# EAGLE board BRD1001-001-002-320 - Switching Register (EAGLE 9.4.2)
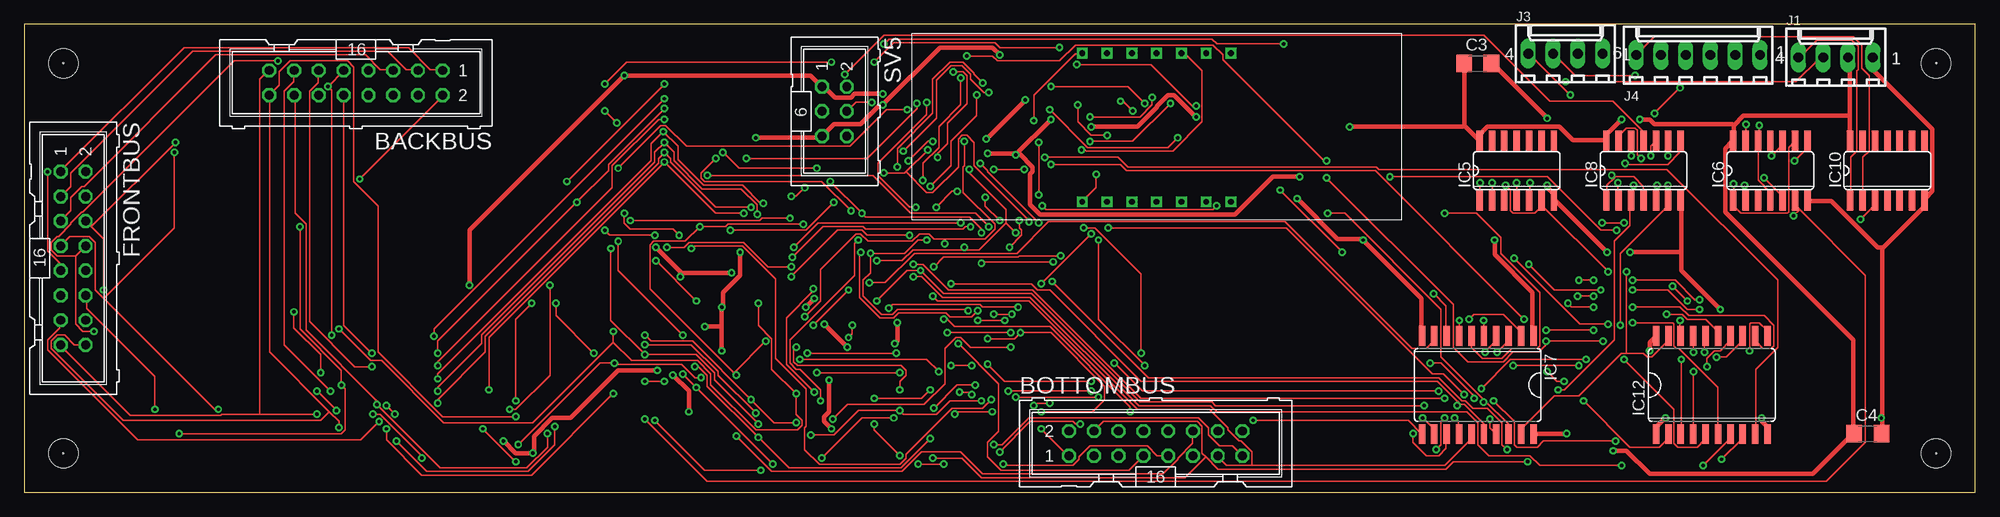
[diagram p1: board, top side]
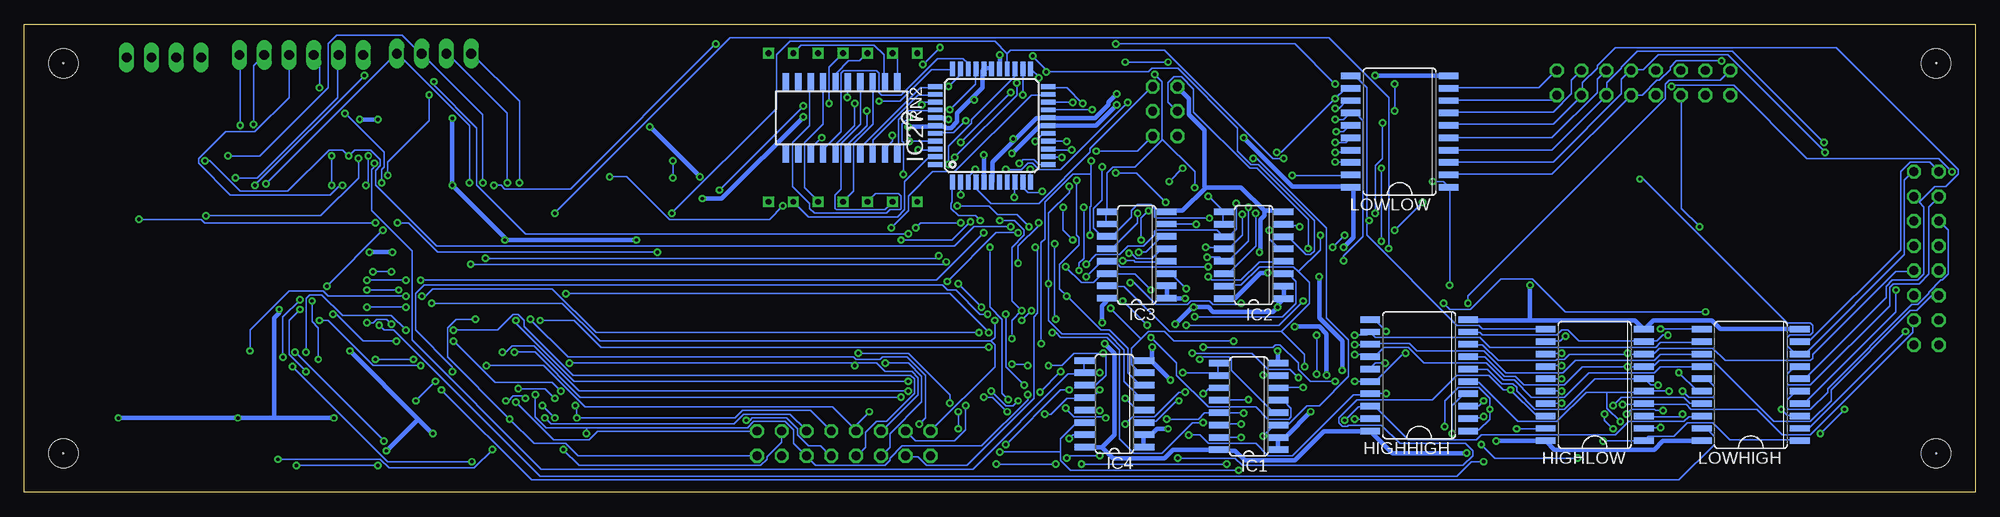
[diagram p2: board, bottom side, seen from below]

Size 200 x 48 mm. Coordinates in mm from the lower left corner, seen from the top.
Outline: 0,0 200,0 200,48 0,48 0,0
Copper layers (1*16): Top 0.035mm / dielectric 1.5mm / Bottom 0.035mm
Design rules "default *": minimum track width 6mil, minimum drill 0.35mm, track to track 6mil, track to pad 6mil, pad to pad 6mil, via to via 6mil, smd to smd 6mil, copper to edge 40mil, drill to drill 6mil, minimum pad ring 10mil, minimum via ring 8mil, stop-mask expansion 4mil, vias tented up to drill 0mil, thermal gap 10mil
Net classes: 2 power: width 0.457 mm
Holes 0.12 mm at 4,4 196,44 4,44 196,4
Holes 3 mm at 4,44 4,4 196,4 196,44

## Footprints (pad centres in the part's own frame; a part is rotated, then mirrored left to right if it is on the bottom)
ML16 = drill 0.914 octagon: 1 -8.89,-1.27; 2 -8.89,1.27; 3 -6.35,-1.27; 4 -6.35,1.27; 5 -3.81,-1.27; 6 -3.81,1.27; 7 -1.27,-1.27; 8 -1.27,1.27; 9 1.27,-1.27; 10 1.27,1.27; 11 3.81,-1.27; 12 3.81,1.27; 13 6.35,-1.27; 14 6.35,1.27; 15 8.89,-1.27; 16 8.89,1.27
C1206 = smd 1.6 x 1.8: 1 -1.4,0; 2 1.4,0
SO20W = smd 0.66 x 2.032: 1 -5.715,-5.029; 2 -4.445,-5.029; 3 -3.175,-5.029; 4 -1.905,-5.029; 5 -0.635,-5.029; 6 0.635,-5.029; 7 1.905,-5.029; 8 3.175,-5.029; 9 4.445,-5.029; 10 5.715,-5.029; 11 5.715,5.029; 12 4.445,5.029; 13 3.175,5.029; 14 1.905,5.029; 15 0.635,5.029; 16 -0.635,5.029; 17 -1.905,5.029; 18 -3.175,5.029; 19 -4.445,5.029; 20 -5.715,5.029
SO16 = smd 0.66 x 2.032: 1 -4.445,-3.073; 2 -3.175,-3.073; 3 -1.905,-3.073; 4 -0.635,-3.073; 5 0.635,-3.073; 6 1.905,-3.073; 7 3.175,-3.073; 8 4.445,-3.073; 9 4.445,3.073; 10 3.175,3.073; 11 1.905,3.073; 12 0.635,3.073; 13 -0.635,3.073; 14 -1.905,3.073; 15 -3.175,3.073; 16 -4.445,3.073
SO14 = smd 0.66 x 2.032: 1 -3.81,-3.073; 2 -2.54,-3.073; 3 -1.27,-3.073; 4 0,-3.073; 5 1.27,-3.073; 6 2.54,-3.073; 7 3.81,-3.073; 8 3.81,3.073; 9 2.54,3.073; 10 1.27,3.073; 11 0,3.073; 12 -1.27,3.073; 13 -2.54,3.073; 14 -3.81,3.073
TQFP44 = smd 1.5 x 0.5: 1 -5.8,4; 2 -5.8,3.2; 3 -5.8,2.4; 4 -5.8,1.6; 5 -5.8,0.8; 6 -5.8,0; 7 -5.8,-0.8; 8 -5.8,-1.6; 9 -5.8,-2.4; 10 -5.8,-3.2; 11 -5.8,-4; 23 5.8,-4; 24 5.8,-3.2; 25 5.8,-2.4; 26 5.8,-1.6; 27 5.8,-0.8; 28 5.8,0; 29 5.8,0.8; 30 5.8,1.6; 31 5.8,2.4; 32 5.8,3.2; 33 5.8,4 | smd 0.5 x 1.5: 12 -4,-5.8; 13 -3.2,-5.8; 14 -2.4,-5.8; 15 -1.6,-5.8; 16 -0.8,-5.8; 17 0,-5.8; 18 0.8,-5.8; 19 1.6,-5.8; 20 2.4,-5.8; 21 3.2,-5.8; 22 4,-5.8; 34 4,5.8; 35 3.2,5.8; 36 2.4,5.8; 37 1.6,5.8; 38 0.8,5.8; 39 0,5.8; 40 -0.8,5.8; 41 -1.6,5.8; 42 -2.4,5.8; 43 -3.2,5.8; 44 -4,5.8
6410-04 = drill 1.016 long: 1 3.81,0; 2 1.27,0; 3 -1.27,0; 4 -3.81,0
6410-06 = drill 1.016 long: 1 6.35,0; 2 3.81,0; 3 1.27,0; 4 -1.27,0; 5 -3.81,0; 6 -6.35,0
SOMC20 = smd 1.91 x 0.64: 1 -3.62,5.715; 2 -3.62,4.445; 3 -3.62,3.175; 4 -3.62,1.905; 5 -3.62,0.635; 6 -3.62,-0.635; 7 -3.62,-1.905; 8 -3.62,-3.175; 9 -3.62,-4.445; 10 -3.62,-5.715; 11 3.62,-5.715; 12 3.62,-4.445; 13 3.62,-3.175; 14 3.62,-1.905; 15 3.62,-0.635; 16 3.62,0.635; 17 3.62,1.905; 18 3.62,3.175; 19 3.62,4.445; 20 3.62,5.715
ML6 = drill 0.914 octagon: 1 -2.54,-1.27; 2 -2.54,1.27; 3 0,-1.27; 4 0,1.27; 5 2.54,-1.27; 6 2.54,1.27
4-DIGIT-7-SEGMENT = drill 0.6 square: PIN1 17.48,1.88; PIN2 20.02,1.88; PIN3 22.56,1.88; PIN4 25.1,1.88; PIN5 27.64,1.88; PIN6 30.18,1.88; PIN7 32.72,1.88; PIN8 32.72,17.12; PIN9 30.18,17.12; PIN10 27.64,17.12; PIN11 25.1,17.12; PIN12 22.56,17.12; PIN13 20.02,17.12; PIN14 17.48,17.12

## Placement (x,y rotation side)
BACKBUS  [ML16]  34,42 180 top
BOTTOMBUS  [ML16]  116,5 0 top
C3  1uF  [C1206]  149,44 0 top
C4  1uF  [C1206]  189,6 0 top
FRONTBUS  [ML16]  5,24 270 top
HIGHHIGH  74AC245DW  [SO20W]  57,12 90 bottom
HIGHLOW  74AC245DW  [SO20W]  39,11 90 bottom
IC1  74HC173D  [SO16]  74.47,8.8 90 bottom
IC2  74HC173D  [SO16]  73.96,24.32 90 bottom
IC3  74HC173D  [SO16]  85.95,24.34 90 bottom
IC4  74HC173D  [SO16]  88.25,9.07 90 bottom
IC5  74ALS21D  [SO14]  153,33 0 top
IC6  74ALS21D  [SO14]  179,33 0 top
IC7  74AC245DW  [SO20W]  149,11 180 top
IC8  74ALS08D  [SO14]  166,33 0 top
IC10  74LS32D  [SO14]  191,33 0 top
IC12  74AC245DW  [SO20W]  173,11 0 top
IC27  MEGA8535-A  [TQFP44]  100.83,37.62 90 bottom
J1  22-27-2041-04  [6410-04]  185.7,44.61 0 top
J3  22-27-2041-04  [6410-04]  158,45 0 top
J4  22-27-2061-06  [6410-06]  171.6,44.86 0 top
LOWHIGH  74AC245DW  [SO20W]  23,11 90 bottom
LOWLOW  74AC245DW  [SO20W]  59,37 90 bottom
RN2  [SOMC20]  116.21,38.41 270 bottom
SV5  [ML6]  83.05,39.08 270 top
U$1  4-DIGIT-7-SEGMENT  [4-DIGIT-7-SEGMENT]  90.98,27.92 0 top

## Tracks (layer width: path | path; a pad name or v marks a point on that pad's centre or on a via)
!HIGH_HIGH  (via drill 0.35)
  Top 0.152: v63.62,7.5 70,1.12 184.75,1.12 188.75,5.12 188.75,22.25 182,29 | 182,29 181.62,29.38 181.62,29.88 IC6.6 | v165.75,34.25 165.38,34.62 165.38,37.12 165.12,37.38 164.25,37.38 163.5,36.62 163.5,36.12 IC8.13 | 182,29 v181.38,28.38
  Bottom 0.152: v63.62,7.5 62.12,7.5 HIGHHIGH.19 | v165.75,34.25 165.75,32.25 169.62,28.38 v181.38,28.38
!HIGH_LOW  (via drill 0.35)
  Top 0.152: v50.38,3.12 v47,6.5 | v163.62,17.12 163.62,24.5 168.5,29.38 168.5,29.88 IC8.6 168.5,30 v168.5,31.5 | v168.5,34.5 168.5,36 IC8.9
  Bottom 0.152: v47,6.5 44.12,6.5 HIGHLOW.19 | v50.38,3.12 51.62,3.12 53.12,1.62 147.12,1.62 162.12,16.62 163.12,16.62 v163.62,17.12 | v168.5,31.5 v168.5,34.5
!IN  (via drill 0.35)
  Top 0.152: IC6.4 179,30.75 177.75,32 177.75,36 IC6.12 177.75,36.12 177.88,36.25 v177.88,37.62
  Bottom 0.152: v177.88,37.62 177.88,44.75 J4.1
!IN_HIGH_HIGH  (via drill 0.35)
  Top 0.152: v178.38,32.25 180.25,30.38 180.25,30 IC6.5
  Bottom 0.152: v178.38,32.25 176.12,32.25 167.88,40.5 167.88,44.75 J4.5
!IN_HIGH_LOW  (via drill 0.35)
  Top 0.152: v167.38,31.5 167.38,30 IC8.5
  Bottom 0.152: v167.38,31.5 167.62,31.5 168.62,30.5 178.88,30.5 182.12,33.75 182.12,34.25 179.38,37 176.38,37 172.88,40.5 172.88,44.75 J4.3
!IN_LOW_HIGH  (via drill 0.35)
  Top 0.152: v163.38,31.75 163.38,30 IC8.2 | v169.75,41.5 v167.12,38.88
  Bottom 0.152: v163.38,31.75 163.38,33.12 163.12,33.38 163.12,34.88 v167.12,38.88 | v169.75,41.5 169.75,44.25 170.25,44.75 J4.4
!IN_LOW_LOW  (via drill 0.35)
  Top 0.152: v176.5,37.75 176.5,36.12 IC6.13
  Bottom 0.152: v176.5,37.75 176.5,43.75 175.5,44.75 J4.2
!LOW_HIGH  (via drill 0.35)
  Top 0.152: v157.25,10.5 157.88,10.5 163,15.62 163,25.75 164.62,27.38 164.62,29.88 IC8.3 164.75,30 165,30.25 v165,31.5 | v164.75,34.5 164.75,36 IC8.12
  Bottom 0.152: v157.25,10.5 148,1.25 30.38,1.25 26.75,4.88 26.75,5.75 27.5,6.5 28,6.5 LOWHIGH.19 | v164.75,34.5 164.75,31.75 v165,31.5
!LOW_LOW  (via drill 0.35)
  Top 0.152: v70,32.5 87,32.5 90.88,28.62 97.5,28.62 v98.88,27.25 | v166.75,34.5 166.75,35.5 167.25,36 IC8.10 | v181.5,34 182.75,35.25 182.75,36 IC6.8
  Bottom 0.152: v70,32.5 64.12,32.5 LOWLOW.19 | v98.88,27.25 102.62,27.25 104.62,25.25 157.75,25.25 164,31.5 164,33 163.5,33.5 163.5,34.12 164.5,35.12 166.12,35.12 v166.75,34.5 167.38,35.12 168.75,35.12 173,30.88 177.88,30.88 181,34 v181.5,34
!OUT  (via drill 0.35)
  Top 0.152: IC6.9 181.5,36 180.88,35.38 180.88,28.75 180.75,28.62 176,28.62 175.25,29.38 175.25,29.88 IC6.1 175.25,30 v175.25,31.62 | v154.38,31.75 154.38,30 IC5.5
  Bottom 0.152: v154.38,31.75 154.38,37.62 161.75,45 J3.1 161.88,45 v175.25,31.62
!OUT_HIGH  (via drill 0.35)
  Top 0.152: v150.5,31.75 150.5,30 IC5.2 | v176.38,31.5 176.38,30 IC6.2 | v165.12,42.75 159,42.75 156.75,45 J3.3
  Bottom 0.152: v150.5,31.75 150.5,38.88 156.62,45 J3.3 | v165.12,42.75 v176.38,31.5
!OUT_LOW  (via drill 0.35)
  Top 0.152: v153,31.75 IC5.4 | v179.12,34.5 180.25,35.62 180.25,36 IC6.10
  Bottom 0.152: v153,31.75 153,38.75 159.25,45 J3.2 159.38,45 161.25,46.88 168,46.88 168.88,46 168.88,41.5 175.88,34.5 v179.12,34.5
!OUT_SWAP  (via drill 0.35)
  Top 0.152: 163,32.25 163.12,32.38 165,32.38 166,31.38 IC8.4 | 163,32.25 162.25,31.5 162.25,30 IC8.1 | v149.25,31.75 149.25,30 IC5.1 | v162.75,32.5 163,32.25 | v158.5,40.75 154.25,45 J3.4
  Bottom 0.152: v149.25,31.75 149.25,40.12 154.12,45 J3.4 | v162.75,32.5 162.75,33.88 158.5,38.12 v158.5,40.75
!REG_IN_HIGH  (via drill 0.35)
  Top 0.152: v164.12,33.75 164.25,33.62 168.5,33.62 169.75,34.88 169.75,36 IC8.8 | v89.75,12.25 v81.25,12.25
  Bottom 0.152: 77.62,12.25 77.62,13.12 IC1.9 | 77.62,12.25 77.62,12 IC1.10 77.62,12.25 | IC4.10 91.38,12.25 91.38,13.5 IC4.9 | v164.12,33.75 164.12,33.38 164.38,33.12 164.38,28.88 160.25,24.75 160.25,15.62 147,2.38 102.75,2.38 93,12.12 91.38,12.12 IC4.10 | v81.25,12.25 77.62,12.25 | v89.75,12.25 91.25,12.25 IC4.10
!REG_IN_LOW  (via drill 0.35)
  Top 0.152: IC8.11 166,37 162.88,40.12 156.38,40.12 149.62,46.88 88.12,46.88 v84.12,42.88 | v78.62,30.38 79.12,30.38 v80,31.25
  Bottom 0.152: IC2.10 77.12,27.5 77.12,28.75 IC2.9 77.12,28.88 v78.62,30.38 | IC3.10 89.12,27.62 89.12,28.75 IC3.9 89,28.88 89,32.75 88.38,33.38 86.12,33.38 83.38,36.12 83.38,36.25 | v84.12,42.88 83.38,42.12 83.38,36.25 | v80,31.25 80,32.88 83.38,36.25
!REG_OUT  (via drill 0.35)
  Top 0.152: 164.25,14.25 166,14.25 166.38,13.88 166.88,13.88 168.5,15.5 168.5,16 IC12.19 | 164.25,14.25 163.75,14.25 159.38,9.88 156.88,9.88 153.5,6.5 153.5,6 IC7.19 | 155.62,29.38 155.62,29.88 IC5.6 155.62,29.38 | v162.38,22.62 155.62,29.38 | 164.25,14.25 v164.25,22.62 | v49.75,8.5 50.38,8.5 53.88,12 v53.88,21.25 | v38.12,5.25 41.25,2.12 51.62,2.12 54.38,4.88 v54.38,6.75 | 155.62,29.38 154.88,28.62 152.62,28.62 152.38,28.88 152.38,31 v151.88,31.5 | v129.12,46 122.25,46 121.75,46.5 88.62,46.5 v88.12,46 | v55.62,31.88 v65.62,41.88
  Bottom 0.152: v164.25,22.62 v162.38,22.62 | LOWHIGH.1 18,5.38 25.12,5.38 26.88,7.12 29.5,7.12 30.88,5.75 33.5,5.75 33.88,5.38 HIGHLOW.1 34,5.25 v38.12,5.25 | v53.88,21.25 53.88,31.25 LOWLOW.1 54,31.38 54.5,31.88 v55.62,31.88 | HIGHHIGH.1 51.88,6.38 50.88,6.38 49.75,7.5 v49.75,8.5 49.75,9.62 50.88,10.75 53,10.75 54.38,9.38 v54.38,6.75 | v151.88,31.5 151.12,31.5 150.75,31.12 144,31.12 v129.12,46 | v88.12,46 69.75,46 v65.62,41.88
A
  Bottom 0.152: IC27.37 106.75,39.12 109.5,39.12 110.38,38.25 110.38,34.88 RN2.20
B  (via drill 0.35)
  Top 0.152: v108,39.75 108,38 109.38,36.62 v111,36.62
  Bottom 0.152: v108,39.75 107.75,40 106.75,40 IC27.36 | v111,36.62 111,36 111.75,35.25 111.75,34.88 RN2.19
BUS0  (via drill 0.35)
  Top 0.152: v78.5,28.12 75.62,28.12 75.38,27.88 v62.12,27.88 | v104.62,34.38 112.12,34.38 113.12,33.38 138.62,33.38 138.88,33.12 168.38,33.12 179.75,21.75 179.75,14.88 177.5,12.62 177.5,6 IC12.9 | v98.25,42 97.38,42.88 97.38,43 96.25,44.12 94.88,44.12 93.12,42.38 93.12,38.88 89.5,35.25 v89.5,33.38
  Bottom 0.152: 62.38,27.88 62.38,41.5 63.5,42.62 64,42.62 LOWLOW.11 | 62.38,27.88 62.38,26.38 53.12,17.12 50.88,17.12 50.5,16.75 44.12,16.75 HIGHLOW.11 | v78.5,28.12 84,28.12 84.12,28.25 84.12,29.12 84.5,29.5 85.88,29.5 86.5,28.88 86.5,28.25 88.5,26.25 89,26.25 IC3.11 89.12,26.25 89.5,26.25 90.38,27.12 90.38,29.12 89.5,30 v89.5,33.38 | 62.38,27.88 v62.12,27.88 | v104.62,34.38 98.25,40.75 v98.25,42
BUS1  (via drill 0.35)
  Top 0.152: v42,16 42,16.75 v65.62,40.38 | v82.62,31.88 v85.88,28.62 86.25,28.25 96.88,28.25 98.12,27 v98.12,26.62 | v81.25,33.25 73.25,33.25 v71.62,34.88 | v174,3.38 176.12,5.5 176.12,5.88 IC12.8 | v152,4.38 151.5,4.88 151.5,7.12 150,8.62 148.5,8.62 147.75,9.38 147.38,9.38 145,11.75 115.25,11.75 v105.38,21.62
  Bottom 0.152: v42,16 42.5,15.5 44,15.5 HIGHLOW.12 | LOWLOW.12 64.12,41.38 64.62,41.38 v65.62,40.38 71.12,34.88 v71.62,34.88 | v85.88,28.62 85.88,27.62 88.5,25 89,25 IC3.12 | v81.25,33.25 v82.62,31.88 | v174,3.38 163.5,3.38 162.62,2.5 153.88,2.5 v152,4.38 | v105.38,21.62 100.38,26.62 v98.12,26.62
BUS2  (via drill 0.35)
  Top 0.152: v42.38,14.25 42.38,15.5 v56.62,29.75 59.88,33 59.88,33.62 v65.62,39.38 | v78.62,23.12 76.25,23.12 73.75,25.62 68.12,25.62 67.62,25.12 v65.88,25.12 | v64.62,26.38 60,26.38 v59.5,26.88 | v172.12,2.75 174.88,5.5 174.88,5.88 IC12.7 | v163.75,2.75 155.38,2.75 154.38,3.75 150.12,3.75 149,4.88 149,7.12 147.88,8.25 122.25,8.25 121.62,8.88 114.25,8.88 103.12,20 94.12,20 92,22.12 v91.12,22.12
  Bottom 0.152: v42.38,14.25 44,14.25 HIGHLOW.13 | v65.62,39.38 65.25,39.38 64.5,40.12 64.12,40.12 LOWLOW.13 | v78.62,23.12 87.62,23.12 88.12,23.62 89,23.62 IC3.13 89.12,23.62 89.62,23.62 v91.12,22.12 | v64.62,26.38 v65.88,25.12 | v56.62,29.75 v59.5,26.88 | v163.75,2.75 v172.12,2.75
BUS3  (via drill 0.35)
  Top 0.152: v42.38,13 42.38,13.38 60.25,31.25 60.25,33.5 65,38.25 v65.62,38.25 | v80.88,17.12 v84.5,20.75 | v64.75,23.75 v68.88,19.62 | v164.88,17.38 169,17.38 169.12,17.25 169.12,15 169.38,14.75 169.62,14.75 173.62,10.75 173.62,6 IC12.6 | v162.38,17.25 159.5,17.25 v152.75,24 | v106.25,24.25 102,24.25 101.88,24.12 94.25,24.12 v93.25,23.12
  Bottom 0.152: v42.38,13 44,13 HIGHLOW.14 | v65.62,38.25 64.75,38.25 64.12,38.88 LOWLOW.14 64,38.88 63.5,38.88 62.75,38.12 62.75,26.25 64.75,24.25 v64.75,23.75 | v84.5,20.75 86.12,22.38 89,22.38 IC3.14 89.12,22.38 89.5,22.38 90.38,21.5 91.62,21.5 v93.25,23.12 | v80.88,17.12 71.38,17.12 v68.88,19.62 | v164.88,17.38 164.25,17.38 163.88,17.75 162.88,17.75 v162.38,17.25 | v152.75,24 106.5,24 v106.25,24.25
BUS4  (via drill 0.35)
  Top 0.152: v42.38,11.62 42.38,12.12 64.25,34 64.25,35.75 v65.5,37 67,35.5 67,34.12 69.62,31.5 73.62,31.5 75.5,29.62 v75.75,29.62 | v164,13.62 169.12,8.5 169.12,5 169.5,4.62 171.5,4.62 172.25,5.38 172.25,5.88 IC12.5 | v160.12,13.62 152.38,13.62 v149.38,10.62 | v145.62,9.62 114.5,9.62 103.38,20.75 94.75,20.75 92.12,23.38 v91.12,23.38
  Bottom 0.152: v42.38,11.62 44,11.62 HIGHLOW.15 | v65.5,37 64.75,37 64.12,37.62 LOWLOW.15 | v75.75,29.62 75.75,27 76.5,26.25 77,26.25 IC2.11 77.12,26.25 77.75,26.88 84,26.88 84.12,26.75 84.12,26.38 85.25,25.25 86.88,25.25 87.75,24.38 90.12,24.38 v91.12,23.38 | v160.12,13.62 v164,13.62 | v149.38,10.62 146.62,10.62 v145.62,9.62
BUS5  (via drill 0.35)
  Top 0.152: v42.38,10.38 42.38,10.75 46.88,15.25 46.88,16.12 64.62,33.88 64.62,34.88 v65.62,35.88 66.62,34.88 66.62,34 69.5,31.12 73.5,31.12 75.12,29.5 v75.12,28.5 | v171.12,12.38 171.12,6 IC12.4 | v171.75,18.75 170.5,18.75 168.5,20.75 v164.88,20.75 | v161.62,20.75 156.88,20.75 v154.25,23.38 | v105.5,23.62 98.25,23.62 v98.12,23.5 | v96,27.62 81.38,27.62 v78.88,25.12
  Bottom 0.152: v42.38,10.38 44,10.38 HIGHLOW.16 | v65.62,35.88 64.5,35.88 64.12,36.25 LOWLOW.16 | v75.12,28.5 75.12,26.38 76.5,25 77,25 IC2.12 77.12,25 77.25,25.12 v78.88,25.12 | v171.12,12.38 172.88,14.12 172.88,17.62 v171.75,18.75 | v161.62,20.75 v164.88,20.75 | v154.25,23.38 105.75,23.38 v105.5,23.62 | v98.12,23.5 98.12,25.25 96,27.38 v96,27.62
BUS6  (via drill 0.35)
  Top 0.152: v42.38,9.12 42.38,9.5 47.25,14.38 47.25,16 65,33.75 65,34.25 v65.62,34.88 66.25,34.25 66.25,33.88 70.88,29.25 v74.5,29.25 | v169.88,13.62 169.88,6 IC12.3 | v169,21.12 v170.5,19.62 | v163.25,26.88 161.62,26.88 156.12,32.38 v140,32.38 | v122.25,29.38 121.88,29 104.75,29 v104.38,29.38 | v97,27.25 96.5,27.25 96.25,27 86.25,27 86,27.25 81.88,27.25 v78.75,24.12
  Bottom 0.152: v42.38,9.12 44,9.12 HIGHLOW.17 | v65.62,34.88 64.25,34.88 64.12,35 LOWLOW.17 | v74.5,29.25 74.5,25.75 76.5,23.75 77,23.75 IC2.13 77.12,23.75 77.5,24.12 v78.75,24.12 | v169.88,13.62 169.88,16.88 170.5,17.5 v170.5,19.62 | v163.25,26.88 v169,21.12 | v140,32.38 138.25,32.38 133.88,28 123.62,28 v122.25,29.38 | v104.38,29.38 101.12,29.38 100.25,28.5 98.25,28.5 v97,27.25
BUS7  (via drill 0.35)
  Top 0.152: v47.62,10.5 47.62,15.88 v65.62,33.88 70.88,28.62 v73.75,28.62 | v159.88,9.38 164.62,4.62 167.62,4.62 168.5,5.5 168.5,5.88 IC12.2 | v157.88,11.38 157.12,11.38 v156.12,12.38 | v99.38,18.25 v101.25,18.25 | v97.5,11 95.62,11 v93.25,8.62 | v89.12,7.62 85.88,7.62 v81.75,3.5
  Bottom 0.152: v65.62,33.88 64.12,33.88 LOWLOW.18 | HIGHLOW.18 44.12,7.88 45,7.88 v47.62,10.5 48.38,10.5 49.88,12 53.12,12 55.62,9.5 63.38,9.5 65.25,7.62 65.25,7.12 64.88,6.75 64.38,6.75 64.25,6.88 60.88,6.88 59,5 52.25,5 51.5,4.25 51.5,3.75 52.5,2.75 75.12,2.75 75.88,3.5 v81.75,3.5 | v73.75,28.62 73.75,25.25 76.5,22.5 77,22.5 IC2.14 | v157.88,11.38 v159.88,9.38 | v156.12,12.38 156.12,12.88 159.88,16.62 159.88,20.38 159,21.25 105.88,21.25 105.38,20.75 104.5,20.75 102,18.25 v101.25,18.25 | v99.38,18.25 99.38,12.88 v97.5,11 | v93.25,8.62 92.38,7.75 89.25,7.75 v89.12,7.62
BUS8  (via drill 0.35)
  Top 0.152: v32.25,16.75 35.5,13.5 36.62,13.5 43,7.12 52.12,7.12 60.38,15.38 | v60.38,16.5 60.38,15.38 | 60.38,15.38 62.25,13.5 69,13.5 70.38,12.12 70.38,11 75,6.38 79.25,6.38 79.75,6.88 79.75,7.38 79.12,8 v79.12,10.12 76.62,12.62 76.62,15.75 75.25,17.12 v75.25,19.38 | v86.62,21.5 88.25,21.5 91.25,24.5 101.75,24.5 105,27.75 129.25,27.75 142.25,14.75 143.75,14.75 144.5,15.5 144.5,16 IC7.9
  Bottom 0.152: v32.25,16.75 28.12,16.75 LOWHIGH.11 | v60.38,16.5 61.5,17.62 62,17.62 HIGHHIGH.11 | v79.12,10.12 78.62,10.62 77.62,10.62 IC1.11 | v86.62,21.5 86.25,21.5 84,19.25 80.75,19.25 80.38,19.62 78.5,19.62 78.12,19.25 75.38,19.25 v75.25,19.38
BUS9  (via drill 0.35)
  Top 0.152: v63.62,16.12 64.25,15.5 68.5,15.5 v74.5,9.5 76.88,7.12 v79.12,7.12 | v144.5,20.38 145.75,19.12 145.75,16.12 IC7.8 | v94.62,16.38 v101.12,16.38
  Bottom 0.152: LOWHIGH.12 28.12,15.38 32.25,15.38 32.75,14.88 49.75,14.88 50.75,15.88 61.5,15.88 62,16.38 HIGHHIGH.12 62.12,16.38 62.38,16.12 v63.62,16.12 | v74.5,9.5 77.5,9.5 IC1.12 | v144.5,20.38 105.12,20.38 v101.12,16.38 | v94.62,16.38 94.25,16.38 93.75,15.88 89,15.88 87.75,14.62 87.75,5.5 86.25,4 83.38,4 80.25,7.12 v79.12,7.12
BUS10  (via drill 0.35)
  Top 0.152: v75,8.12 71.12,12 71.12,12.38 68.38,15.12 v63.62,15.12 | v147.12,17.62 147.12,16.12 IC7.7 | v101.12,14.88 97,14.88 96,15.88 95.5,15.88 94.38,14.75 94.38,11.12 92.25,9 84.38,9 v82.88,7.5
  Bottom 0.152: LOWHIGH.13 28.12,14.12 32.25,14.12 32.88,13.5 41,13.5 42.25,12.25 48.12,12.25 50.38,14.5 57.25,14.5 58,15.25 62,15.25 HIGHHIGH.13 62.12,15.12 v63.62,15.12 | v75,8.12 77.5,8.12 IC1.13 77.62,8.12 79,8.12 79.62,7.5 v82.88,7.5 | v147.12,17.62 143.62,17.62 140.88,14.88 v101.12,14.88
BUS11  (via drill 0.35)
  Top 0.152: v75.25,7 70.75,11.5 70.75,12.25 68.88,14.12 v63.62,14.12 60.12,17.62 v60.12,25 | v145.62,28.62 148.88,28.62 151.38,26.12 151.38,24.5 155.38,20.5 155.38,15 155.12,14.75 152.5,14.75 151.5,13.75 149.5,13.75 148.38,14.88 148.38,16 IC7.6
  Bottom 0.152: LOWHIGH.14 28.12,12.88 32.25,12.88 32.88,12.25 39.62,12.25 42.12,9.75 45.5,9.75 47.25,11.5 48.38,11.5 50.12,13.25 56.5,13.25 58.12,14.88 60.62,14.88 61.5,14 62,14 HIGHHIGH.14 62.12,14 62.25,14.12 v63.62,14.12 | v75.25,7 77.5,7 IC1.14 | v145.62,28.62 127.62,46.62 66.25,46.62 60.12,40.5 v60.12,25
BUS12  (via drill 0.35)
  Top 0.152: v32,8.38 v30,10.38 | v35.75,8 36.5,8 40.75,3.75 v40.75,3.5 | v50.62,4.88 59,13.25 v60.5,13.25 60.62,13.12 67.38,13.12 68.75,11.75 v69.38,11.75 | v80.25,14.25 v89.38,14.25 | v149.62,17.62 149.62,16.12 IC7.5 | v109.38,11.38 100.5,11.38 v98.75,13.12 | v95,13 v97.12,13
  Bottom 0.152: v30,10.38 29.38,9.75 26.88,9.75 26.75,9.88 26.75,10.88 27.5,11.62 28,11.62 LOWHIGH.15 | v32,8.38 32.75,8.38 32.88,8.5 35.25,8.5 v35.75,8 | v40.75,3.5 49.25,3.5 v50.62,4.88 | v60.5,13.25 61.5,13.25 62,12.75 HIGHHIGH.15 | v80.25,14.25 74.12,14.25 72.5,12.62 70.25,12.62 v69.38,11.75 | IC4.11 91.25,11 90.12,11 89.12,12 89.12,14 v89.38,14.25 92.38,14.25 93.62,13 v95,13 | v149.62,17.62 149.62,17.38 143.62,11.38 v109.38,11.38 | v98.75,13.12 97.25,13.12 v97.12,13
BUS13  (via drill 0.35)
  Top 0.152: v89.75,10.5 89.75,11.38 90.38,12 90.38,12.5 89.88,13 79.25,13 78.88,13.38 78.88,14.62 v79.12,14.88 | v63.62,11.38 v65.62,11.38 | v30.38,12.25 30.38,14.12 27.62,16.88 v27.62,18.5 | v54.5,19.38 54.5,18.12 v58.38,14.25 | v149.75,14.38 150.88,15.5 150.88,16 IC7.4 | v101.62,9.75 v110.12,9.75 | v99.25,8.25 95.62,8.25 v95.38,8
  Bottom 0.152: v89.75,10.5 90.5,9.75 91.25,9.75 IC4.12 91.38,9.62 93.12,9.62 94.75,8 v95.38,8 | v79.12,14.88 72,14.88 71.75,15.12 71.25,15.12 69.38,13.25 69.38,12.62 68.12,11.38 v65.62,11.38 | v63.62,11.38 62.12,11.38 HIGHHIGH.16 62,11.38 61.5,11.38 58.62,14.25 v58.38,14.25 | v30.38,12.25 28.5,10.38 28.12,10.38 LOWHIGH.16 | v27.62,18.5 42,18.5 45.38,21.88 48.62,21.88 51.75,18.75 53.88,18.75 v54.5,19.38 | v149.75,14.38 147.62,14.38 143,9.75 v110.12,9.75 | v101.62,9.75 100.75,9.75 v99.25,8.25
BUS14  (via drill 0.35)
  Top 0.152: v38,8 v37.12,8.88 | v37.12,6.5 37.12,5.38 40.75,1.75 52,1.75 v60.38,10.12 | v80.62,5.88 83,5.88 85.5,8.38 v89.75,8.38 90.12,8 93.5,8 94.88,9.38 v98.12,9.38 | v151,14.38 152.12,15.5 152.12,16 IC7.3 | v100.88,10.38 v109.38,10.38
  Bottom 0.152: v37.12,8.88 36.25,9.75 29.88,9.75 29.25,9.12 28.12,9.12 LOWHIGH.17 | v38,8 38,7.38 v37.12,6.5 | v60.38,10.12 62,10.12 HIGHHIGH.17 62.12,10 63.75,10 70,3.75 72.5,3.75 73.75,5 78.62,5 79.5,5.88 v80.62,5.88 | v89.75,8.38 91.25,8.38 IC4.13 | v151,14.38 150.62,14.38 150,15 147.75,15 143.12,10.38 v109.38,10.38 | v100.88,10.38 99.38,8.88 98.62,8.88 v98.12,9.38
BUS15  (via drill 0.35)
  Top 0.152: v75.5,2.25 69.75,2.25 v64.62,7.38 | v148.12,17.75 148.62,18.25 151.62,18.25 153.38,16.5 153.38,16.12 IC7.2 | v108.25,7 107.75,7 107.5,7.25 103.12,7.25 v100,4.12
  Bottom 0.152: LOWHIGH.18 28.12,7.75 29.38,7.75 29.88,7.25 35.5,7.25 36.88,5.88 50.62,5.88 51.12,5.38 58.12,5.38 61.5,8.75 62,8.75 HIGHHIGH.18 62.12,8.75 63.25,8.75 v64.62,7.38 | 93.75,4.12 93.75,3.25 92.75,2.25 v75.5,2.25 | 93.75,4.12 93.75,5.5 92.12,7.12 91.38,7.12 IC4.14 | v148.12,17.75 144.25,13.88 115,13.88 114.75,13.62 112.25,13.62 112,13.88 109.5,13.88 107.62,12 107.62,7.62 v108.25,7 | 93.75,4.12 v100,4.12
C
  Bottom 0.152: IC27.35 106.75,40.75 108.38,40.75 113,36.12 113,34.88 RN2.18
CLEAR  (via drill 0.35)
  Top 0.152: v68.75,12.88 69.12,12.88 70,12 70,10.88 v75.25,5.62 78.38,2.5 89.88,2.5 v92.88,5.5 | v188.25,28 189.62,29.38 189.62,29.88 IC10.3 | v161.75,27.62 v164,27.62 | v128.75,31 v135.12,24.62 | v120.12,39.62 119.75,39.62 115.5,43.88 v107.88,43.88 | v106.12,45.62 100,45.62 99.5,46.12 89.12,46.12 v87.12,44.12 | v82.75,44.12 61.75,44.12 v59.5,41.88 | v60.75,37.88 v59.5,39.12 | v61.5,28.62 61.5,27.62 62.12,27 66.5,27 v67.12,26.38
  Bottom 0.152: 69.38,22.62 68.25,21.5 68.25,19.38 71.12,16.5 | 69.38,22.62 69.88,23.12 73.38,23.12 75.25,21.25 77,21.25 IC2.15 | 71.12,16.5 82.62,16.5 87.25,21.12 89,21.12 IC3.15 | v75.25,5.62 IC1.15 | v68.75,12.88 68.75,14.12 71.12,16.5 | v92.88,5.5 92.5,5.88 91.38,5.88 IC4.15 | v188.25,28 181.88,28 181.5,27.62 v164,27.62 | v161.75,27.62 160.62,27.62 157.62,24.62 v135.12,24.62 | v120.12,39.62 v128.75,31 | v106.12,45.62 v107.88,43.88 | v82.75,44.12 v87.12,44.12 | v59.5,39.12 v59.5,41.88 | v60.75,37.88 60.75,34.25 61.5,33.5 v61.5,28.62 | v67.12,26.38 67.12,24.88 69.38,22.62
CLK  (via drill 0.35)
  Top 0.152: v79.88,27.5 72.12,27.5 71.88,27.25 v69.25,27.25 67.75,25.75 64.5,25.75 64.12,25.38 64.12,20.88 72.75,12.25 | 72.75,12.25 v76,15.5 | 72.75,12.25 v73,12 | v158,42.12 181.62,42.12 184,44.5 184.38,44.5 J1.3 | v104.25,21.38 v109.38,26.5 | v101.88,19 98.25,19 98,19.25 89,19.25 v88.62,18.88
  Bottom 0.152: v69.25,27.25 69.38,27.38 70.88,27.38 IC2.7 | v79.88,27.5 82.88,27.5 IC3.7 | v73,12 71.5,12 IC1.7 | 85.5,15.75 84.75,16.5 83.12,16.5 82.12,15.5 v76,15.5 | 85.5,15.75 86.5,14.75 86.5,13.12 85.62,12.25 85.25,12.25 IC4.7 | v158,42.12 158,41.75 153.62,37.38 153.62,31.5 148.62,26.5 v109.38,26.5 | v101.88,19 v104.25,21.38 | 85.5,15.75 v88.62,18.88
D
  Bottom 0.152: IC27.34 106.75,41.5 108.12,41.5 114.25,35.38 114.25,34.88 RN2.17
DIG0  (via drill 0.35)
  Top 0.152: v103.5,38.12 103.5,40.75 107.75,45 108.38,45 U$1.PIN14
  Bottom 0.152: v103.5,38.12 104.75,36.88 106.62,36.88 IC27.40
DIG1  (via drill 0.35)
  Top 0.152: v109.25,36 113.62,36 v117.5,39.88
  Bottom 0.152: v109.25,36 106.75,36 IC27.41 | v117.5,39.88 117.5,43.62 116.12,45 U$1.PIN11
DIG2  (via drill 0.35)
  Top 0.152: v108.38,35.12 108.75,35.12 108.88,35 117.75,35 120.75,38 120.75,43.25 119,45 118.62,45 U$1.PIN10
  Bottom 0.152: v108.38,35.12 106.75,35.12 IC27.42
DIG3
  Bottom 0.152: IC27.43 106.75,34.38 107.25,34.38 109.75,31.88 109.75,29 110.5,28.25 119.62,28.25 121.12,29.75 U$1.PIN6
DP  (via drill 0.35)
  Top 0.152: v105.12,39.25 109,35.38 117.25,35.38 v118.25,36.38
  Bottom 0.152: v105.12,39.25 102.5,41.88 102.5,43.38 IC27.30 | v118.25,36.38 119.38,35.25 119.38,34.88 RN2.13
E  (via drill 0.35)
  Top 0.152: v112.38,40.12 112.62,40.12 v113.62,39.12
  Bottom 0.152: v112.38,40.12 110.25,40.12 107,43.38 104.88,43.38 IC27.33 | v113.62,39.12 113.62,37.62 115.5,35.75 115.5,34.88 RN2.16
F  (via drill 0.35)
  Top 0.152: v105.25,41.62 113.12,41.62 v114.88,39.88
  Bottom 0.152: v105.25,41.62 104.12,42.75 104.12,43.38 IC27.32 | v114.88,39.88 114.88,37.62 116.75,35.75 116.75,34.88 RN2.15
G
  Bottom 0.152: IC27.31 103.25,43.5 103.25,44 103.75,44.5 106.38,44.5 110.12,40.75 112.12,40.75 112.38,41 112.38,43 112.62,43.25 116,43.25 116.25,43 116.25,37 118,35.25 118,34.88 RN2.14
GND  (via drill 0.35)
  Top 0.457: v156.12,38.38 150.5,44 C3.2 | v156.12,31.5 156.12,31.25 156.75,30.62 156.75,30 IC5.7 157,29.88 v162.25,24.62 | IC7.10 143.25,16.12 143.25,19.88 v137.25,25.88 137.12,26 134.62,26 v130.5,30.12 | v150.75,25.88 150.75,24.38 154.62,20.5 154.62,16.12 IC7.1 | v168.25,7.62 167.38,6.75 167.38,6 IC12.1 | v178.12,7.62 178.12,7.25 178.62,6.75 178.62,6 IC12.10 | 169.88,24.62 169.88,22.75 v173.88,18.75 | 169.88,24.62 169.88,29.88 IC8.7 | 190.5,25 190.5,7.62 | 190.5,7.62 190.5,6 C4.2 | 190.5,25 194.75,29.25 194.75,29.88 IC10.7 194.88,30.12 195.62,30.88 195.62,37.25 189.62,43.25 189.62,44.5 J1.1 | IC6.7 182.88,29.88 185.25,29.88 190,25.12 190.38,25.12 190.5,25 | v190.38,7.62 190.5,7.62 | 169.88,24.62 v164.62,24.62 | v82.5,11.5 82.5,8.25 82,7.75 82,7.25 v82.75,6.5 | 71.5,17 v71.5,19 71.62,19.12 71.62,20.5 73.38,22.25 v73.38,24.62 | 71.5,17 v71.5,14.5 | v68.12,8.25 68.12,10.38 v66.5,12 | 71.5,17 v69.75,17 | v80.12,19 v81,19.88 | v82,17.25 v84.38,14.88 | v98.62,36.25 v102.62,40.25 | v88,40.88 85.12,40.88 84.75,40.5 83.12,40.5 82,41.62 SV5.1 81.75,41.62 80.62,42.75 v61.5,42.75 45.62,26.88 v45.62,21.25 | v120.12,38.5 117.88,40.75 117.25,40.75 116.12,39.62 116.12,39.5 114.12,37.5 v109.38,37.5
  Bottom 0.457: v156.12,38.38 v156.12,31.5 150.62,26 | v137.25,25.88 150.5,25.88 150.62,26 | v150.75,25.88 150.62,26 | 174.38,7.62 v178.12,7.62 v190.38,7.62 | 174.38,7.62 v168.25,7.62 | v173.88,18.75 173.88,18.38 174.38,17.88 174.38,7.62 | v164.62,24.62 v162.25,24.62 | LOWHIGH.10 18,16.75 26.12,16.75 27,17.62 33,17.62 33.88,16.75 HIGHLOW.10 34.12,16.88 34.88,17.62 45.62,17.62 | 45.62,17.62 51.88,17.62 HIGHHIGH.10 | IC4.1 85.25,4.62 85.25,5.88 IC4.2 85,6 84.38,6 83.88,6.5 v82.75,6.5 | v82.5,11.5 84.5,13.5 85.12,13.5 IC4.8 84.38,13.62 v84.38,14.88 | IC3.2 82.88,21.12 82.88,20 IC3.1 82.75,19.88 v81,19.88 | IC1.1 71.5,4.38 71.5,5.62 IC1.2 71.25,5.75 70.62,5.75 v68.12,8.25 | IC2.2 70.88,21.12 70.88,19.88 IC2.1 71,19.75 71.5,19.25 v71.5,19 72,18.5 78.12,18.5 78.62,19 v80.12,19 80.25,19 v82,17.25 | v71.5,14.5 71.5,13.25 IC1.8 | v66.5,12 66.5,16.25 67.25,17 v69.75,17 | IC27.28 100.88,43.5 101.62,43.5 IC27.29 101.75,43.25 101.75,41.5 102.88,40.38 | 102.88,40.38 104.38,38.88 104.38,38 105,37.38 105.5,37.38 105.62,37.5 106.62,37.5 IC27.39 106.75,37.5 v109.38,37.5 | 98.5,36.12 100.75,33.88 100.75,31.88 IC27.6 | 98.5,36.12 96.25,38.38 95.12,38.38 IC27.18 94.88,38.38 90.25,38.38 88.88,39.75 88.88,40 v88,40.88 | v102.62,40.25 102.75,40.25 102.88,40.38 | v98.62,36.25 98.5,36.12 | 72.88,28.88 71,28.88 IC2.8 | 72.88,28.88 75.25,31.25 78.88,31.25 | 78.88,31.25 81.25,28.88 82.88,28.88 IC3.8 | v61.5,42.75 54,42.75 LOWLOW.10 | 78.88,31.25 79,31.38 79,37.12 80.62,38.75 80.62,40.38 81.75,41.5 SV5.1 | v73.38,24.62 73.38,24.88 73.25,25 73.25,28 72.88,28.38 72.88,28.88 | v45.62,21.25 45.62,17.62 | v130.5,30.12 128.5,30.12 v120.12,38.5
IN2_CLEAR
  Top 0.152: IC10.1 187.25,30 187.25,34.38 187.88,35 187.88,43.25 188,43.38 188,45.75 187.38,46.38 183.75,46.38 182,44.62 J1.4
IN_CLEAR
  Top 0.152: IC10.2 188.5,30 188.5,34.38 189.12,35 189.12,42.75 188.38,43.5 188.38,45.88 187.5,46.75 167.12,46.75 165.25,44.88 J4.6
MAIN_BUS0
  Top 0.152: BACKBUS.1 42.88,43.38 41.62,43.38 39.38,45.62 16.38,45.62 3.75,33 FRONTBUS.1
  Bottom 0.152: LOWLOW.9 53.88,41.5 44.75,41.5 43,43.25 BACKBUS.1 | LOWHIGH.9 17.88,15.5 17,15.5 7.62,24.88 7.62,32.88 6.62,33.88 4.62,33.88 3.75,33 FRONTBUS.1
MAIN_BUS1  (via drill 0.35)
  Top 0.152: v34.38,32.12 42.88,40.62 BACKBUS.2
  Bottom 0.152: LOWLOW.8 53.88,40.25 43.38,40.25 43,40.62 BACKBUS.2 | FRONTBUS.2 6.38,32.88 7.25,32 7.25,24.38 17.38,14.25 17.88,14.25 LOWHIGH.8 18,14.25 18.5,14.25 19.25,15 19.25,15.88 19,16.12 16.88,16.12 16.62,16.38 16.62,17.12 16.88,17.38 19.25,17.38 34,32.12 v34.38,32.12
MAIN_BUS2
  Top 0.152: BACKBUS.3 40.25,43.38 39.12,43.38 37.25,45.25 17.25,45.25 4.75,32.75 4.75,31.38 3.75,30.38 FRONTBUS.3
  Bottom 0.152: LOWLOW.7 53.88,39 43.25,39 41.38,40.88 41.38,42.25 40.38,43.25 BACKBUS.3 | LOWHIGH.7 18,12.88 18.5,12.88 19.25,12.12 19.25,11.12 19.12,11 16.88,11 8.75,19.12 8.75,21 8.38,21.38 5.75,21.38 4.75,22.38 4.75,29.25 3.75,30.25 FRONTBUS.3
MAIN_BUS3
  Bottom 0.152: LOWLOW.6 53.88,37.75 43.25,37.75 40.38,40.62 BACKBUS.4 40.25,40.75 40.25,42 38.75,43.5 38.75,43.75 36.88,45.62 14.25,45.62 1.75,33.12 1.75,32.62 3,31.38 4.12,31.38 5.75,29.75 | 5.75,29.75 6.25,30.25 FRONTBUS.4 | 5.75,29.75 5.25,29.25 5.25,22.38 5.88,21.75 8.5,21.75 9.12,21.12 9.12,20 17.38,11.75 17.88,11.75 LOWHIGH.6
MAIN_BUS4
  Top 0.152: BACKBUS.5 37.75,43.38 36.5,43.38 35,44.88 19.62,44.88 6.12,31.38 5.88,31.38 4.75,30.25 4.75,28.88 3.75,27.88 FRONTBUS.5
  Bottom 0.152: LOWLOW.5 53.88,36.38 43.38,36.38 38.75,41 38.75,42.38 37.88,43.25 BACKBUS.5 | LOWHIGH.5 18,10.25 18.5,10.25 19.25,9.5 19.25,8.62 19.12,8.5 16.88,8.5 15.12,10.25 15.12,10.62 6.5,19.25 5.88,19.25 4.75,20.38 4.75,20.5 3.5,21.75 3.38,21.75 2.75,22.38 2.75,26.88 3.62,27.75 FRONTBUS.5
MAIN_BUS5  (via drill 0.35)
  Top 0.152: v8.12,20.75 8.12,26 6.88,27.25 | 6.88,27.25 6.38,27.75 FRONTBUS.6 | 6.88,27.25 v15.5,35.88
  Bottom 0.152: LOWLOW.4 53.88,35.12 43.38,35.12 37.88,40.62 BACKBUS.6 37.75,40.75 37.75,42 36.25,43.5 36.25,43.62 34.62,45.25 24.88,45.25 v15.5,35.88 | v8.12,20.75 8.12,18.5 17.5,9.12 17.88,9.12 LOWHIGH.4
MAIN_BUS6  (via drill 0.35)
  Top 0.152: v19.88,8.5 19.5,8.5 8.12,19.88 | 8.12,19.88 7.25,20.75 7.25,25.62 6.62,26.25 4.62,26.25 3.75,25.38 FRONTBUS.7 | v15.38,34.88 15.38,27.12 8.12,19.88
  Bottom 0.152: LOWLOW.3 53.88,33.88 43.25,33.88 36.25,40.88 36.25,42.38 35.38,43.25 BACKBUS.7 35.25,43.38 34,43.38 32.5,44.88 25.38,44.88 v15.38,34.88 | v19.88,8.5 19.25,7.88 18,7.88 LOWHIGH.3
MAIN_BUS7  (via drill 0.35)
  Top 0.152: v7.12,16.5 6,16.5 5.25,17.25 5.25,24.25 | FRONTBUS.8 5.25,24.25 | v26,44.25 21.5,44.25 6,28.75 5.88,28.75 4.75,27.62 4.75,27.5 3.5,26.25 3.38,26.25 2.75,25.62 2.75,24.88 3.38,24.25 5.25,24.25
  Bottom 0.152: LOWLOW.2 53.88,32.62 43.38,32.62 BACKBUS.8 35.25,40.75 34.12,40.75 32.62,42.25 32.38,42.25 31.25,43.38 31.25,43.62 30.62,44.25 v26,44.25 | v7.12,16.5 17,6.62 17.88,6.62 LOWHIGH.2
MAIN_BUS8  (via drill 0.35)
  Top 0.152: v2.38,32.88 2.38,24.75 3.62,23.5 3.62,22.75 FRONTBUS.9 | BACKBUS.9 32.75,43.25 v31.12,41.62 31.5,41.25 v31.5,16.12
  Bottom 0.152: HIGHHIGH.9 51.88,16.38 50.75,16.38 50.5,16.12 42.88,16.12 42.38,16.62 41.75,16.62 40.62,15.5 34,15.5 HIGHLOW.9 33.88,15.5 32.62,15.5 32,16.12 v31.5,16.12 | v2.38,32.88 3.75,34.25 17.25,34.25 24.75,41.75 31,41.75 v31.12,41.62
MAIN_BUS9  (via drill 0.35)
  Top 0.152: v35.62,14.25 32.75,17.12 32.75,40.62 BACKBUS.10
  Bottom 0.152: 35.62,14.12 41.62,14.12 42.12,13.62 42.88,13.62 43,13.5 48.88,13.5 50.5,15.12 51.88,15.12 HIGHHIGH.8 | 35.62,14.12 34,14.12 HIGHLOW.8 33.88,14.25 32.88,14.25 32.38,14.75 26.88,14.75 25.62,13.5 16.88,13.5 16.62,13.75 16.62,14.12 8.12,22.62 6.38,22.62 FRONTBUS.10 | 35.62,14.12 v35.62,14.25
MAIN_BUS10  (via drill 0.35)
  Top 0.152: v35.62,12.88 33.88,12.88 29.25,17.5 29.25,41.12 30.12,42 30.12,43.25 BACKBUS.11
  Bottom 0.152: HIGHHIGH.7 51.88,13.88 50.25,13.88 48.25,11.88 47.12,11.88 46.25,11 42.12,11 40.25,12.88 v35.62,12.88 34,12.88 HIGHLOW.7 33.88,13 32.88,13 32.38,13.5 26.88,13.5 20.62,7.25 16.88,7.25 14.75,9.38 14.75,10.5 6.62,18.62 6,18.62 4.5,20.12 3.75,20.12 FRONTBUS.11
MAIN_BUS11  (via drill 0.35)
  Top 0.152: v13.38,8.5 13.38,11.88 6.38,18.88 6.38,20.12 FRONTBUS.12 | v15.88,6 32.5,6 32.88,6.38 32.88,10.62 v32.5,11 32.5,12.5 28.25,16.75 v28.25,27.25
  Bottom 0.152: HIGHHIGH.6 51.88,12.62 50,12.62 48.5,11.12 47.38,11.12 47,10.75 47,10.38 45.12,8.5 42.12,8.5 39,11.62 34,11.62 HIGHLOW.6 33.88,11.62 33.25,11 v32.5,11 | v15.88,6 v13.38,8.5 | v28.25,27.25 30.12,29.12 30.12,40.62 BACKBUS.12
MAIN_BUS12  (via drill 0.35)
  Top 0.152: v36.38,7.25 34.5,5.38 11.62,5.38 2.38,14.62 2.38,15.62 3.62,16.88 3.62,17.62 FRONTBUS.13 | v31.38,10.38 26.62,15.12 26.62,41.12 27.62,42.12 27.62,43.25 BACKBUS.13
  Bottom 0.152: 37.75,10.25 39.88,10.25 42.88,7.25 46.88,7.25 50.88,11.25 51.88,11.25 HIGHHIGH.5 | 37.75,10.25 34,10.25 HIGHLOW.5 33.88,10.38 v31.38,10.38 | v36.38,7.25 37.75,8.62 37.75,10.25
MAIN_BUS13  (via drill 0.35)
  Top 0.152: v53.62,6 53.62,4.62 51.5,2.5 42.62,2.5 v36.12,9 36.12,9.38 28.88,16.62 28.88,27.5 27.75,28.62 27.75,40.62 BACKBUS.14
  Bottom 0.152: FRONTBUS.14 6.38,17.62 6.38,16.38 16.88,5.88 19.75,5.88 22.38,8.5 29.12,8.5 29.62,9 33.88,9 HIGHLOW.4 34,9 v36.12,9 | v53.62,6 53.62,8.88 52.5,10 52,10 HIGHHIGH.4
MAIN_BUS14  (via drill 0.35)
  Top 0.152: 24.12,8 20.25,8 20.12,7.88 10.88,7.88 3.75,15 FRONTBUS.15 | 24.12,8 v30,8 | v50.38,9.38 50.38,17.75 v52,19.38 | 24.12,8 24.12,42.38 25,43.25 BACKBUS.15
  Bottom 0.152: v30,8 30.25,7.75 33.88,7.75 HIGHLOW.3 | v50.38,9.38 50.88,8.88 51.88,8.88 HIGHHIGH.3 | v52,19.38 52,20.12 31.75,40.38 31.75,41.88 31.38,42.25 26.12,42.25 25.12,43.25 BACKBUS.15
MAIN_BUS15  (via drill 0.35)
  Top 0.152: v32.25,6.62 32.25,7.25 31.25,8.25 | 31.25,8.25 25.12,14.38 25.12,40.62 BACKBUS.16 25.12,40.75 26.12,41.75 26.12,43.12 27.25,44.25 33.12,44.25 33.75,43.62 33.75,31.88 36.25,29.38 36.25,14.38 42.88,7.75 v50.38,7.75 | 31.25,8.25 30.38,7.38 10.12,7.38 2.75,14.75 2.75,15.5 3.38,16.12 4.12,16.12 5.12,15.12 6.25,15.12 FRONTBUS.16
  Bottom 0.152: v32.25,6.62 33.88,6.62 HIGHLOW.2 | v50.38,7.75 50.5,7.62 51.88,7.62 HIGHHIGH.2
N$18  (via drill 0.35)
  Top 0.152: v102,27.88 102,27.12 102.25,26.88 102.25,26.38 v101,25.12 | v99.12,9.5 98.25,8.62 95.12,8.62 90.38,3.88 90.38,3.5 89.75,2.88 81.5,2.88 80,4.38 80,6.62 80.12,6.75 80.12,10.62 77,13.75 77,21.88 73.62,25.25 68.62,25.25 v68.38,25
  Bottom 0.152: v102,27.88 102.5,28.38 104.25,28.38 105,29.12 105,29.62 104.88,29.75 104.88,31.75 IC27.1 | v101,25.12 101,19 99.75,17.75 99.75,10.12 v99.12,9.5 | v68.38,25 68.38,28 73.62,33.25 74.38,33.25 80.12,39 80.12,41.38 81.38,42.62 82.12,42.62 82.75,42 82.75,40 81.88,39.12 SV5.3
N$19  (via drill 0.35)
  Top 0.152: v99.38,33.12 v102.5,33.12 | v86.88,40 85.25,40 84.38,39.12 SV5.4
  Bottom 0.152: v102.5,33.12 103.12,32.5 103.12,31.88 IC27.3 | v99.38,33.12 97.75,33.12 97.12,33.75 96.62,33.75 96,33.12 93.75,33.12 v86.88,40
N$20  (via drill 0.35)
  Top 0.152: v104,35.88 v104,30.5 | v98.88,41 98.38,41 97,42.38 97,42.88 96.12,43.75 95,43.75 93.5,42.25 93.5,38.38 v90.12,35
  Bottom 0.152: v104,30.5 104,31.75 IC27.2 | v98.88,41 v104,35.88 | v90.12,35 85.88,35 84.38,36.5 SV5.6
N$21
  Bottom 0.152: IC27.4 102.38,31.75 102.38,31.12 100.88,29.62 96,29.62 90.75,34.88 90.75,35.25 84.38,41.62 SV5.2
N$24
  Bottom 0.152: RN2.1 110.5,42.12 110.5,44.5 111,45 U$1.PIN13
N$25
  Bottom 0.152: RN2.2 111.88,42.12 111.88,44.88 112.88,45.88 120.38,45.88 121.12,45.12 U$1.PIN9
N$26
  Bottom 0.152: RN2.3 113,42 113,37.75 115,35.75 115,30.88 116,29.88 U$1.PIN4
N$27
  Bottom 0.152: RN2.4 114.25,42 114.25,37.75 116.25,35.75 116.25,31.12 116.88,30.5 116.88,29.12 116.75,29 111.75,29 111,29.75 U$1.PIN2
N$28  (via drill 0.35)
  Top 0.152: v115.62,40.5 115.62,39.75 114.38,38.5 v109.25,38.5 | v109.88,32.62 109.88,31.25 108.5,29.88 U$1.PIN1
  Bottom 0.152: v115.62,40.5 115.62,42 RN2.5 | v109.25,38.5 110,37.75 110,36 109.88,35.88 v109.88,32.62
N$29
  Bottom 0.152: RN2.6 116.75,42.12 116.75,43 115.5,44.25 114.38,44.25 113.62,45 U$1.PIN12
N$30
  Bottom 0.152: RN2.7 118.12,42 118.12,37.75 120,35.88 120,31.25 118.62,29.88 U$1.PIN5
N$31
  Bottom 0.152: RN2.8 119.5,42 119.5,37.62 121.25,35.88 121.25,31.38 119.5,29.62 119.5,29.12 119,28.62 111.62,28.62 111.25,29 110.25,29 110.12,29.12 110.12,30.38 110.38,30.62 112.75,30.62 113.5,29.88 U$1.PIN3
SIGNAL0  (via drill 0.35)
  Top 0.152: v98.5,30.25 98.5,29.38 v100,27.88 | v97.75,18.62 97.12,18 94.88,18 94.5,18.38 89.62,18.38 89.12,17.88 87.75,17.88 85.62,20 85.62,24.5 v85.75,24.62 | v176.88,14.5 176.88,17.25 177,17.38 177.88,17.38 178.62,16.62 178.62,16.12 IC12.11 | v159.25,20.12 v160.88,20.12 | v98.75,15.75 101.5,15.75 v102.12,16.38 105.25,16.38 110.75,10.88 110.75,9.5 109.5,8.25 v104.25,8.25 | v104.25,6.5 107,3.75 BOTTOMBUS.1
  Bottom 0.152: v98.5,30.25 98.5,31.75 IC27.9 | v100,27.88 98.5,27.88 97.5,26.88 97.5,26.38 98.75,25.12 98.75,19.62 v97.75,18.62 98.75,17.62 v98.75,15.75 | v85.75,24.62 85,24.62 83.5,26.12 83,26.12 IC3.6 | v176.88,14.5 176.88,16.62 172.88,20.62 169.38,20.62 168.88,20.12 v160.88,20.12 | v159.25,20.12 158.88,20.12 158.12,20.88 145.88,20.88 141.38,16.38 v102.12,16.38 | v104.25,8.25 v104.25,6.5
SIGNAL1  (via drill 0.35)
  Top 0.152: v95.62,30.88 95.12,30.88 v93.5,29.25 | v92.5,25.88 91.62,25.88 90.25,24.5 v86.75,24.5 86.75,22.5 86,21.75 86,20.12 87.88,18.25 89,18.25 89.5,18.75 96.62,18.75 v96.75,18.62 | v164.88,19 169.75,19 170.62,18.12 178.38,18.12 179.38,17.12 179.38,15 179.12,14.75 178.25,14.75 177.5,15.5 177.5,16 IC12.12 | v160.88,19 158.62,19 v158.25,19.38 | v100.5,17.62 v97.75,17.62
  Bottom 0.152: v95.62,30.88 95.75,30.75 97.12,30.75 97.62,31.25 97.62,31.75 IC27.10 | v93.5,29.25 93.5,26.88 v92.5,25.88 | v86.75,24.5 86.5,24.5 86,24 84.38,24 83.5,24.88 83,24.88 IC3.5 | v160.88,19 v164.88,19 | v158.25,19.38 144.88,19.38 141,15.5 100.88,15.5 | 100.88,15.5 100.5,15.12 100.5,12.88 107,6.38 BOTTOMBUS.2 | v97.75,17.62 v96.75,18.62 | v100.5,17.62 100.5,15.88 100.88,15.5
SIGNAL2  (via drill 0.35)
  Top 0.152: v96.88,33.12 96.88,32.75 100.62,29 100.62,27.62 | 100.62,27.62 97.88,24.88 96.38,24.88 | 96.38,24.88 91.12,24.88 90,23.75 v87.38,23.75 | v173.5,13.88 174.5,13.88 176.12,15.5 176.12,16 IC12.13 | v171.75,19.75 171.25,19.75 169.25,21.75 v164.88,21.75 | v159.38,21.75 v160.88,21.75 | 100.62,27.62 v101.62,26.62 | 96.38,24.88 v96.38,25.12
  Bottom 0.152: v96.88,33.12 96.88,31.88 IC27.11 | v87.38,23.75 86.25,23.75 86.12,23.62 83,23.62 IC3.4 | v173.5,13.88 173.5,18 v171.75,19.75 | v160.88,21.75 v164.88,21.75 | v159.38,21.75 106.5,21.75 v101.62,26.62 | v96.38,25.12 96.12,24.88 96.12,18.38 96.5,18 96.5,9.62 103.38,2.75 107.5,2.75 108.38,3.62 109.62,3.62 BOTTOMBUS.3
SIGNAL3  (via drill 0.35)
  Top 0.152: v98,33.75 98.75,33 98.75,32.88 v104,27.62 | v108.62,27.12 109.75,27.12 114.5,22.38 v114.5,14.25 | v105.12,9.12 103.75,9.12 v103.5,8.88 | v172.5,12.88 172.5,13.75 173.25,14.5 173.88,14.5 174.88,15.5 174.88,16 IC12.14 | v154.12,3.12 146.5,3.12 145.75,2.38 122.38,2.38 121.12,3.62 | 121.12,3.62 120.75,4 120.75,6.75 120.25,7.25 110.62,7.25 109.75,6.38 BOTTOMBUS.4 | v80.88,20.88 80.88,20.62 78.12,17.88 78.12,13.12 v81,10.25 | v87.12,7 87.12,6.38 v89.75,3.75 | v93.12,3.5 96.12,3.5 98.12,1.5 119,1.5 121.12,3.62
  Bottom 0.152: v98,33.75 97.62,34.12 96.5,34.12 96,33.62 95.12,33.62 IC27.12 | v104,27.62 108.12,27.62 v108.62,27.12 | v114.5,14.25 109.38,14.25 105.12,10 v105.12,9.12 | v103.5,8.88 103.5,6.38 104.62,5.25 108.62,5.25 109.62,6.25 BOTTOMBUS.4 | v172.5,12.88 162.75,3.12 v154.12,3.12 | v80.88,20.88 82.38,22.38 82.88,22.38 IC3.3 | v81,10.25 81.62,10.25 84.12,7.75 86.38,7.75 v87.12,7 | v89.75,3.75 92.88,3.75 v93.12,3.5
SIGNAL4  (via drill 0.35)
  Top 0.152: v93.62,34.38 93.62,34.75 94.62,35.75 94.62,37.88 96.62,39.88 96.62,42.75 96.25,43.12 v95.25,43.12 | v168.38,18.25 170,18.25 170.5,17.75 172.38,17.75 173.62,16.5 173.62,16.12 IC12.15 | v161.88,15.5 v156,15.5 156,15.12 155.25,14.38 152.62,14.38 151.62,13.38 148,13.38 146.5,14.88 146.5,19.25 v133.5,32.25 | v145,10.38 114.62,10.38 v111.75,13.25 | v96.62,44.75 99.25,44.75 99.75,44.25 106.12,44.25 107.75,45.88 121.88,45.88 122.88,44.88 122.88,44.38 133.25,34 v133.5,34
  Bottom 0.152: v93.62,34.38 95,34.38 IC27.13 | IC2.6 70.88,26.12 70.38,26.12 68.62,24.38 68.12,24.38 67.75,24.75 67.75,27.88 73.5,33.62 74.25,33.62 75.62,35 75.62,37.38 81.75,43.5 84.38,43.5 84.75,43.12 v95.25,43.12 95.25,43.38 v96.62,44.75 | v168.38,18.25 168,18.25 165.25,15.5 v161.88,15.5 | v156,15.5 151.75,11.25 145.88,11.25 v145,10.38 | v111.75,13.25 109.38,13.25 108,11.88 108,9.25 111.25,6 111.25,4.62 112.12,3.75 BOTTOMBUS.5 | v133.5,32.25 v133.5,34
SIGNAL5  (via drill 0.35)
  Top 0.152: 90.38,32.88 90.25,32.75 v88.12,32.75 | 90.38,32.88 v92.62,35.12 | v83,29.75 80.12,26.88 v72.38,26.88 | v172.25,14.38 172.25,16 IC12.16 | v163.12,5.25 155.75,5.25 155.12,4.62 153,4.62 152.75,4.88 152.75,7.25 v150.62,9.38 | v148.62,9.62 148.62,9.88 145.25,13.25 v144.12,13.25 | 90.38,32.88 92.5,30.75 93.12,30.75 95.75,33.38 95.75,36.25 96.12,36.62 96.62,36.62 97.38,35.88 97.38,33.5 103,27.88 v103,27.75 | v110.12,25.88 110.12,17.75 v114.88,13
  Bottom 0.152: v92.62,35.12 95,35.12 IC27.14 | v88.12,32.75 86,32.75 v83,29.75 | v72.38,26.88 72.38,26 71.38,25 71,25 IC2.5 | v163.12,5.25 v172.25,14.38 | v150.62,9.38 150.38,9.38 149.88,9.88 148.88,9.88 v148.62,9.62 | 114.88,13.25 112.62,13.25 111.75,12.38 109,12.38 108.38,11.75 108.38,10 112.12,6.25 BOTTOMBUS.6 | 114.88,13.25 v144.12,13.25 | v103,27.75 104.88,25.88 v110.12,25.88 | 114.88,13.25 v114.88,13
SIGNAL6  (via drill 0.35)
  Top 0.152: v93.12,36 92.62,36 v90.62,34 | v90.75,26.38 86.38,26.38 85.88,26.88 83.38,26.88 v78.62,22.12 | v171.12,14.38 171.12,16 IC12.17 | v156,16.62 v160.88,16.62 | v95.75,15.25 99.88,11.12 99.88,6.25 98.75,5.12 98.75,3.62 100.12,2.25 113.25,2.25 BOTTOMBUS.7
  Bottom 0.152: v93.12,36 95,36 IC27.15 | 90.62,32.62 90.62,29.38 90.75,29.25 v90.75,26.38 | 90.62,32.62 v90.62,34 | v78.62,22.12 78.25,21.75 75.25,21.75 73.38,23.62 71,23.62 IC2.4 | v171.12,14.38 171.12,19.88 170.75,20.25 169.5,20.25 167.38,18.12 162.38,18.12 v160.88,16.62 | v156,16.62 151.5,16.62 149.88,18.25 149.38,18.25 148.75,17.62 148.75,17 143.75,12 109.12,12 108.75,11.62 108.75,10.12 111.62,7.25 112.62,7.25 113.75,6.12 113.75,4.62 114.62,3.75 BOTTOMBUS.7 | 90.62,32.62 92.5,32.62 95.38,29.75 95.38,26 95.75,25.62 v95.75,15.25
SIGNAL7  (via drill 0.35)
  Top 0.152: v96.38,36 96.38,33.5 96.25,33.38 96.25,30.75 99.5,27.5 99.5,27 98.5,26 94.38,26 | 94.38,26 93.25,26 92.75,26.5 91.75,26.5 91,25.75 86.5,25.75 85.75,26.5 85.25,26.5 81.62,22.88 81.62,19.62 v80,18 | v169.75,17.62 169.75,16.12 IC12.18 | v152.62,13 v159.38,13 | v94.38,25.5 94.38,26 | v94.25,17.75 94.62,17.75 95.38,17 105.12,17 113.38,8.75 v113.38,8.25
  Bottom 0.152: v96.38,36 95.62,36.75 95.12,36.75 IC27.16 | v80,18 71,18 69.62,19.38 69.62,21.62 70.38,22.38 70.88,22.38 IC2.3 | v169.75,17.62 168.88,17.62 164.25,13 v159.38,13 | v152.62,13 146.75,13 142.5,8.75 117.12,8.75 115,6.62 | 115,6.62 114.75,6.38 BOTTOMBUS.8 115,6.62 | v94.38,25.5 94.38,17.88 v94.25,17.75 | 115,6.62 v113.38,8.25
SIGNAL8  (via drill 0.35)
  Top 0.152: v126,7.38 141.88,7.38 143.25,6 IC7.11 | v90.5,39.25 88.38,39.25 84.62,35.5 67.88,35.5 65.75,37.62 65.25,37.62 v60.88,33.25 | v60.88,25.75 60.88,22.75 v67.5,16.12 | v67.5,12.12 v68.88,10.75 v76.75,2.88 | v100.38,2.88 100.5,2.75 107.5,2.75 108.12,3.38 108.12,3.62 109.25,4.75 115.12,4.75 116.12,3.75 117.25,3.75 BOTTOMBUS.9 | v91.62,2.88 v94.25,2.88
  Bottom 0.152: v126,7.38 125.62,7.38 125.38,7.62 121.88,7.62 120.75,6.5 120.75,5.88 119.62,4.75 118.38,4.75 117.38,3.75 BOTTOMBUS.9 | v90.5,39.25 95,39.25 IC27.19 | v60.88,25.75 v60.88,33.25 | v67.5,12.12 v67.5,16.12 | v68.88,10.75 71.38,10.75 IC1.6 | v94.25,2.88 v100.38,2.88 | v76.75,2.88 v91.62,2.88
SIGNAL9  (via drill 0.35)
  Top 0.152: v143.38,7.62 144.5,6.5 144.5,6 IC7.12 | v92.5,40 92.5,38.75 87.5,33.75 87.5,32.5 90.75,29.25 v91.38,29.25 | v87.38,19.62 90.5,22.75 v91.88,22.75 94.25,20.38 103.25,20.38 114.38,9.25 121.75,9.25 122.12,8.88 v143.5,8.88 | v84.88,17.12 84.88,16.25 v84.5,15.88
  Bottom 0.152: BOTTOMBUS.10 119.38,8.38 126.38,8.38 127.12,7.62 v143.38,7.62 143.38,8.75 v143.5,8.88 | v92.5,40 95,40 IC27.20 | v91.38,29.25 91.38,24 91.88,23.5 v91.88,22.75 | v84.88,17.12 v87.38,19.62 | v84.5,15.88 81.88,13.25 81.88,12 78.62,8.75 73.75,8.75 72.5,7.5 70.38,7.5 70.12,7.75 70.12,8.62 70.88,9.38 71.38,9.38 IC1.5
SIGNAL10  (via drill 0.35)
  Top 0.152: v111.12,27.12 129.38,27.12 144.38,12.12 145.5,12.12 v147.62,10 | v142.38,6 142.38,5.12 143.75,3.75 145,3.75 145.75,4.5 145.75,5.88 IC7.13 | v79.5,13.62 92.5,13.62 v93.75,12.38 | v95.88,10.25 96.88,10.25 v97.12,10
  Bottom 0.152: v111.12,27.12 109.38,28.88 109.38,30.38 106.88,32.88 104.62,32.88 96.75,40.75 95.12,40.75 IC27.21 | v147.62,10 147.62,7.75 146.5,6.62 142.38,6.62 | 142.38,6.62 125.88,6.62 125.25,7.25 122,7.25 121.12,6.38 121.12,5 119.88,3.75 BOTTOMBUS.11 119.75,3.62 118.88,2.75 111.75,2.75 111.25,3.25 111.25,3.5 110,4.75 101.88,4.75 97.12,9.5 v97.12,10 | 142.38,6.62 v142.38,6 | v79.5,13.62 79.25,13.88 76.5,13.88 76.25,13.62 76.25,12.5 72,8.25 71.5,8.25 IC1.4 | v95.88,10.25 v93.75,12.38
SIGNAL11  (via drill 0.35)
  Top 0.152: v146.62,7.62 147,7.25 147,6 IC7.14 | v91.5,39.88 91.5,39.38 86.38,34.25 v74,34.25 | v73,5.75 76.62,2.12 90,2.12 92,4.12 96,4.12 98.25,1.88 116.75,1.88 118.25,3.38 118.25,3.5 119.75,5 119.75,6.25 BOTTOMBUS.12
  Bottom 0.152: v146.62,7.62 146,7 127.25,7 126.25,8 121.5,8 119.88,6.38 BOTTOMBUS.12 | v91.5,39.88 93.12,41.5 95,41.5 IC27.22 | v74,34.25 73.62,34.25 66.5,27.12 66.5,17.88 64.25,15.62 64.25,11.88 67.25,8.88 68.5,8.88 70.38,7 71.38,7 IC1.3 71.5,6.88 71.88,6.88 v73,5.75
SIGNAL12  (via drill 0.35)
  Top 0.152: 125.88,2.75 123.25,2.75 122.38,3.62 BOTTOMBUS.13 | 125.88,2.75 145.62,2.75 148.25,5.38 148.25,5.88 IC7.15 | v96,42.5 96,39.75 93.75,37.5 93.75,35.38 92.12,33.75 v92.12,32 | 125.88,2.75 125.88,4.12 124.75,5.25 124.5,5.25 123.38,6.38 123.38,6.62 121.5,8.5 114.12,8.5 103,19.62 93.62,19.62 v93.12,20.12
  Bottom 0.152: v96,42.5 96,42.62 96.75,43.38 IC27.23 | v92.12,32 92.12,26.38 91.88,26.12 91.88,25.38 93.88,23.38 93.88,20.88 v93.12,20.12 89.62,16.62 88.75,16.62 86.88,14.75 86.88,12.25 85.62,11 85.25,11 IC4.6
SIGNAL13  (via drill 0.35)
  Top 0.152: v97.62,40.75 97.62,38.62 95,36 95,33.5 v92.88,31.38 | 147.12,9.12 144.88,11.38 114.5,11.38 105.12,20.75 103.88,20.75 103.25,21.38 v95,21.38 | 147.12,9.12 147.25,9 147.62,9 149.62,7 149.62,6 IC7.16 | v144.75,4.38 145.25,4.88 145.25,7.25 v145.62,7.62 | 147.12,9.12 v146.88,8.88
  Bottom 0.152: v97.62,40.75 97.62,43.38 IC27.24 | v92.88,31.38 92.88,30.75 95,28.62 v95,21.38 95,17.62 93.62,16.25 88.88,16.25 87.25,14.62 87.25,11.38 85.62,9.75 85.25,9.75 IC4.5 | v144.75,4.38 143.12,2.75 124.5,2.75 123.88,3.38 123.88,3.62 122.38,5.12 122.38,6.25 BOTTOMBUS.14 | v146.88,8.88 v145.62,7.62
SIGNAL14  (via drill 0.35)
  Top 0.152: v87.12,9.62 92,9.62 v92.88,10.5 | v99.38,4.88 100.25,4.88 103,7.62 120.38,7.62 121.38,6.62 121.38,5.88 122.5,4.75 123.88,4.75 124.88,3.75 BOTTOMBUS.15 | v105.25,33.62 112.38,33.62 113,33 138.5,33 v153.75,17.75 | v150.25,7.5 150.25,6.62 150.88,6 IC7.17
  Bottom 0.152: v87.12,9.62 86,8.5 85.25,8.5 IC4.4 | v92.88,10.5 93.75,10.5 v99.38,4.88 | v105.25,33.62 105.25,35.5 102.88,37.88 102.88,38.25 98.5,42.62 98.5,43.38 IC27.25 | v153.75,17.75 155.75,17.75 156.62,16.88 156.62,13.88 v150.25,7.5 147.75,5 144.5,5 143.25,3.75 125,3.75 BOTTOMBUS.15
SIGNAL15  (via drill 0.35)
  Top 0.152: v133.62,28.62 135.38,28.62 145.25,18.75 145.25,13.88 149.75,9.38 | 149.75,9.38 152.12,7 152.12,6 IC7.18 | v81.62,9.38 81.62,10.5 79.5,12.62 79.12,12.62 78.5,13.25 78.5,15.62 85.12,22.25 85.12,25.5 v85.5,25.88 | v84.75,28.88 81.75,31.88 69.75,31.88 69.38,32.25 69.38,32.75 v70.88,34.25 | 149.75,9.38 v149.62,9.25
  Bottom 0.152: 99.25,45 99.25,43.5 IC27.26 | 99.25,45 100.5,46.25 121.5,46.25 122.88,44.88 122.88,39.38 v133.62,28.62 | v81.62,9.38 81.88,9.38 84,7.25 85.12,7.25 IC4.3 | v85.5,25.88 85.5,28.12 v84.75,28.88 | v70.88,34.25 72,34.25 83.12,45.38 98.88,45.38 99.25,45 | v149.62,9.25 145.75,5.38 142.12,5.38 141.25,6.25 125,6.25 BOTTOMBUS.16
VCC  (via drill 0.35)
  Top 0.457: v158.12,6 154.75,6 IC7.20 | v166.62,14.5 166.62,15.38 167.25,16 IC12.20 | 147.62,37.62 147.62,44 C3.1 | 147.62,37.62 149.12,36.12 IC5.14 149,36.5 150,37.5 157.38,37.5 158.75,36.12 162.12,36.12 IC8.14 162.25,36.25 162.25,36.75 v163.75,38.25 | 187.12,38.62 187.12,44.38 187,44.5 J1.2 | 187.12,38.62 187.12,36.12 IC10.14 | 187.12,38.62 176.25,38.62 175.25,37.62 | 175.25,37.62 175.25,36.25 IC6.14 175.12,36 174.38,35.25 174.38,28.75 187.5,15.62 187.5,6 C4.1 187.38,5.88 183.38,1.88 166.62,1.88 164.25,4.25 v162.88,4.25 | v165.62,38.25 166.62,38.25 167.12,37.75 175.12,37.75 175.25,37.62 | 67.38,22.5 v72.5,22.5 | v64.75,25.12 67.38,22.5 | v105.25,38.25 v101.62,34.62 | v100,44.88 99.25,45.62 93.88,45.62 v88,39.75 87.75,39.75 85.75,37.75 83,37.75 81.88,36.62 SV5.5 81.62,36.38 v75,36.38 | v98.75,34.75 101.5,34.75 v101.62,34.62 | v89.5,17.38 89.5,15.5 v89.25,15.25 | v49.12,5.25 50.38,4 v52.12,4 52.25,4.12 52.25,5.75 54.12,7.62 56,7.62 60.88,12.5 v64.88,12.5 | v67.25,22.12 67.25,22.38 67.38,22.5 | v135.88,37.5 147.5,37.5 147.62,37.62 | v130.75,32.38 128,32.38 124.12,28.5 104.12,28.5 103.12,29.5 103.12,32.62 103.38,32.88 103.38,33.38 102,34.75 v101.62,34.62
  Bottom 0.457: v166.62,14.5 159.62,7.5 | 159.62,7.5 v158.12,6 | v165.62,38.25 v163.75,38.25 | v162.88,4.25 159.62,7.5 | IC2.16 75.88,19.88 73.25,22.5 v72.5,22.5 | v64.75,25.12 63.75,26.12 63.75,31 64,31.25 LOWLOW.20 64.25,31.38 70,31.38 v75,36.38 | v101.62,34.62 101.62,31.88 IC27.5 | v105.25,38.25 105.62,38.25 105.75,38.38 106.62,38.38 IC27.38 | v88,39.75 90.12,37.62 95,37.62 IC27.17 95.25,37.62 95.88,37.62 v98.75,34.75 | v100,44.88 100,43.5 IC27.27 | LOWHIGH.20 28.12,5.25 32,5.25 32.88,4.38 43.12,4.38 44,5.25 HIGHLOW.20 44.25,5.25 v49.12,5.25 | 89.5,4.62 88.38,3.5 83.12,3.5 82.25,4.38 77.62,4.38 IC1.16 77.38,4.25 75.88,4.25 74.88,3.25 69.75,3.25 66.75,6.25 62.12,6.25 HIGHHIGH.20 61.88,6.12 59.75,4 v52.12,4 | IC4.16 89.5,4.62 | v89.5,17.38 89.5,19.12 89.12,19.5 89.12,19.88 IC3.16 | v89.25,15.25 88.25,14.25 88.25,5.88 89.5,4.62 | v67.25,22.12 67.25,17.88 64.88,15.5 v64.88,12.5 | v130.75,32.38 v135.88,37.5